# Altium schematic sheet MercurialSDR_FPGA_P&P.SchDoc: p2020 v1
size A4; Author: RF-Lab; DrawnBy: RF-Lab; Revision: Rev1.0; SheetNumber: 4; SheetTotal: 6; ProjectName: MercurialSDR
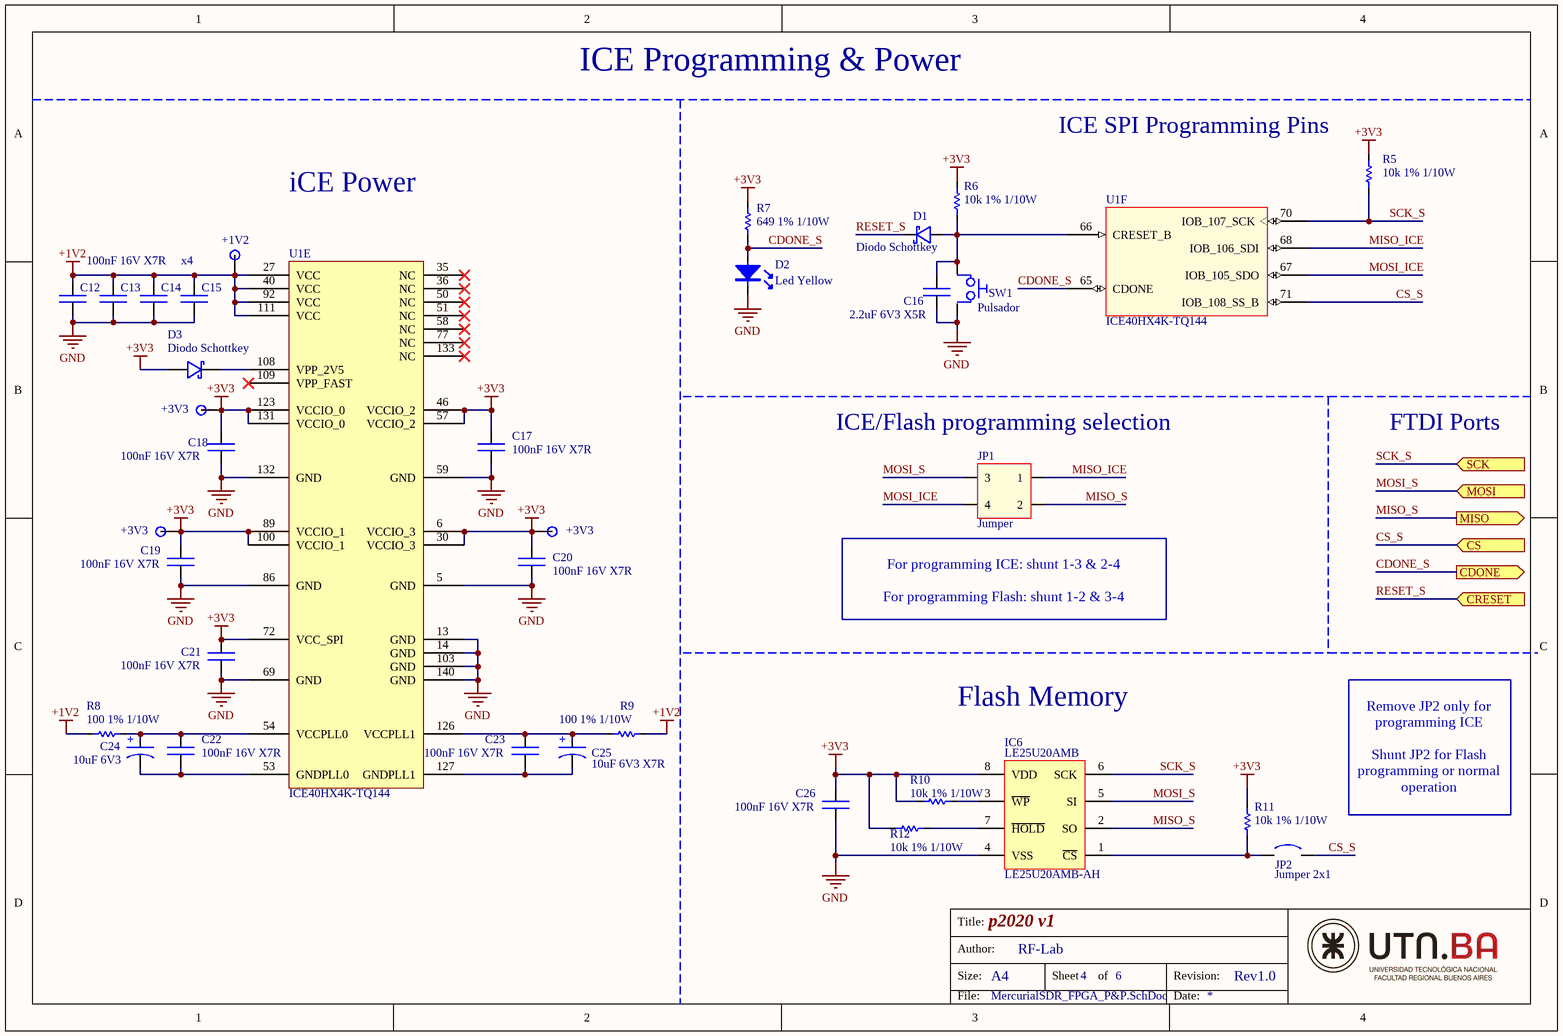
[diagram p0: MercurialSDR_FPGA_P&P.SchDoc]

## Parts
C12  100nF 16V X7R - CL10B104KO8NNNC  [CAP_0603]  (value not drawn)
C13  100nF 16V X7R - CL10B104KO8NNNC  [CAP_0603]  (value not drawn)
C14  100nF 16V X7R - CL10B104KO8NNNC  [CAP_0603]  (value not drawn)
C15  value 100nF 16V X7R  [CAP_0603]  (hidden comment: 100nF 16V X7R - CL10B104KO8NNNC)
C16  value 2.2uF 6V3 X5R  [CAP_0603]  (hidden comment: 2.2uF 6V3 X5R - CL10A225KQ8NNNC)
C17  value 100nF 16V X7R  [CAP_0603]  (hidden comment: 100nF 16V X7R - CL10B104KO8NNNC)
C18  value 100nF 16V X7R  [CAP_0603]  (hidden comment: 100nF 16V X7R - CL10B104KO8NNNC)
C19  value 100nF 16V X7R  [CAP_0603]  (hidden comment: 100nF 16V X7R - CL10B104KO8NNNC)
C20  value 100nF 16V X7R  [CAP_0603]  (hidden comment: 100nF 16V X7R - CL10B104KO8NNNC)
C21  value 100nF 16V X7R  [CAP_0603]  (hidden comment: 100nF 16V X7R - CL10B104KO8NNNC)
C22  value 100nF 16V X7R  [CAP_0603]  (hidden comment: 100nF 16V X7R - CL10B104KO8NNNC)
C23  value 100nF 16V X7R  [CAP_0603]  (hidden comment: 100nF 16V X7R - CL10B104KO8NNNC)
C24  value 10uF 6V3  [CAP_TANT_1206]  (hidden comment: 10uF 6V3 - TAJA106K006RNJ)
C25  value 10uF 6V3 X7R  [CAP_TANT_1206]  (hidden comment: 10uF 6V3 X7R- TAJA106K006RNJ)
C26  value 100nF 16V X7R  [CAP_0603]  (hidden comment: 100nF 16V X7R - CL10B104KO8NNNC)
D1  value Diodo Schottkey  [SOD-523]  (hidden comment: RB521S30T1G)
D2  value Led Yellow  [LED_0603]  (hidden comment: LTST-C190KSKT)
D3  value Diodo Schottkey  [SOD-323]  (hidden comment: NSR0530HT1G)
IC6  LE25U20AMB  Part Number: LE25U20AMB-AH  [SOIC-8]
JP1  Jumper  [Jumper 2x2]
JP2  Jumper 2x1  [Jumper 2x1]
R5  value 10k 1% 1/10W  [RES_0603]  (hidden comment: 10k 1% 1/10W - CR0603-FX-1002EAS)
R6  value 10k 1% 1/10W  [RES_0603]  (hidden comment: 10k 1% 1/10W - CR0603-FX-1002EAS)
R7  value 649 1% 1/10W  [RES_0603]  (hidden comment: 649 1% 1/10W - RC0603FR-07649RL)
R8  value 100 1% 1/10W  [RES_0603]  (hidden comment: 100 1% 1/10W - CR0603-FX-1000ELF)
R9  value 100 1% 1/10W  [RES_0603]  (hidden comment: 100 1% 1/10W - CR0603-FX-1000ELF)
R10  value 10k 1% 1/10W  [RES_0603]  (hidden comment: 10k 1% 1/10W - CR0603-FX-1002EAS)
R11  value 10k 1% 1/10W  [RES_0603]  (hidden comment: 10k 1% 1/10W - CR0603-FX-1002EAS)
R12  value 10k 1% 1/10W  [RES_0603]  (hidden comment: 10k 1% 1/10W - CR0603-FX-1002EAS)
SW1  value Pulsador  [SWITCH_6X6mm]  (hidden comment: PTS645SM43SMTR92 LFS)
TP2  TP Name: +1V2  [TP_TH]  (hidden comment: Test Point)
TP3  TP Name: +3V3  [TP_TH]  (hidden comment: Test Point)
TP4  TP Name: +3V3  [TP_TH]  (hidden comment: Test Point)
TP5  TP Name: +3V3  [TP_TH]  (hidden comment: Test Point)
U1  ICE40HX4K-TQ144  [LATC-TQFP-144_L]  (parts E,F of 6)

## Ports
CDONE (out), CRESET (in), CS (in), MISO (out), MOSI (in), SCK (in)

## Nets
+1V2: C12.1 C13.1 C14.1 C15.1 R8.2 R9.1 TP2.1(TP?) U1.27(VCC) U1.40(VCC) U1.92(VCC) U1.111(VCC)
+3V3: C17.2 C18.2 C19.2 C20.2 C21.2 C26.2 D3.1(A) IC6.8(VDD) R5.1 R6.1 R7.1 R10.1 R11.2 R12.1 TP3.1(TP?) TP4.1(TP?) TP5.1(TP?) U1.6(VCCIO_3) U1.30(VCCIO_3) U1.46(VCCIO_2) U1.57(VCCIO_2) U1.72(VCC_SPI) U1.89(VCCIO_1) U1.100(VCCIO_1) U1.123(VCCIO_0) U1.131(VCCIO_0)
GND: C12.2 C13.2 C14.2 C15.2 C16.2 C17.1 C18.1 C19.1 C20.1 C21.1 C26.1 D2.2(K) IC6.4(VSS) SW1.4 U1.5(GND) U1.13(GND) U1.14(GND) U1.59(GND) U1.69(GND) U1.86(GND) U1.103(GND) U1.132(GND) U1.140(GND)
CDONE_S: D2.1(A) R7.2 U1.65(CDONE) ; port CDONE
CS_S: JP2.2 U1.71(IOB_108_SS_B) ; port CS
MISO_ICE: JP1.1 U1.68(IOB_106_SDI)
MISO_S: IC6.2(SO) JP1.2 ; port MISO
MOSI_ICE: JP1.4 U1.67(IOB_105_SDO)
MOSI_S: IC6.5(SI) JP1.3 ; port MOSI
RESET_S: D1.2(K) ; port CRESET
SCK_S: IC6.6(SCK) R5.2 U1.70(IOB_107_SCK) ; port SCK
NetC16_1: C16.1 D1.1(A) R6.2 SW1.1 U1.66(CRESET_B)
NetC22_1: C22.1 C24.1 R8.1 U1.54(VCCPLL0)
NetC22_2: C22.2 C24.2 U1.53(GNDPLL0)
NetC23_1: C23.1 C25.1 R9.2 U1.126(VCCPLL1)
NetC23_2: C23.2 C25.2 U1.127(GNDPLL1)
NetD3_2: D3.2(K) U1.108(VPP_2V5)
NetIC6_1: IC6.1(~{CS}) JP2.1 R11.1
NetIC6_3: IC6.3(~{WP}) R10.2
NetIC6_7: IC6.7(~{HOLD}) R12.2

Not connected (* = marked no-connect by the designer): SW1 2 3; U1 35(NC)* 36(NC)* 50(NC)* 51(NC)* 58(NC)* 77(NC)* 109(VPP_FAST)* 133(NC)*

## Notes on the sheet
- ICE Programming & Power
- (near R5) ICE SPI Programming Pins
- iCE Power
- x4
- (near JP1) ICE/Flash programming selection
- FTDI Ports
- (near JP1) For programming ICE: shunt 1-3 & 2-4
  For programming Flash: shunt 1-2 & 3-4
- Flash Memory
- Remove JP2 only for programming ICE
  Shunt JP2 for Flash programming or normal operation
- Title:
- Size:
- Author:
- A4
- Sheet
- of
- Revision:
- File:
- Date:
- (in symbol Cap Pol) +

## Library data of the parts
C12 C15-C23 C26 = Cap: Capacitor no polarizado
  C12: Value: 100nF 16V X7R
C13 C14 = Cap: Capacitor no polarizado; Material: Ceramic; Value: 100nF; Temp Coef: X7R; Part Number: CL10B104KO8NNNC; VR: 16V
C24 C25 = Cap Pol: Capacitor polarizado
D1 D3 = Diodo_Schottky: Diodo Schottkey
  D3: Part Number: NSR0530HT1G
D2 = Led
IC6 = LE25U20AMB: Flash Memmory SPI (256Kx8)
JP1 = Jumper 2x2
JP2 = Jumper: Part Number: *
R5-R12 = Res: Resistor
  R9: Power: 1/10W; Part Number: CR0603-FX-1000ELF; Tolerance: 1%
SW1 = Pulsador
U1 = ICE40HX4K-TQ144: iCE40 HX4K Series FPGA Family, 3520 Logic Cells, 1.2 V Core, 80 K Embedded RAM Bits, 144-pin TQFP, Pb-Free, Tray; Manufacturer: Lattice Semiconductor; Phase-Locked Loops: 2; Supply Voltage: 1.2V; Logic Cells: 3520; Embedded RAM Bits: 80K; ComponentLink1Description: Manufacturer URL; ComponentLink2Description: Datasheet; DatasheetVersion: Rev. 02.9; Mounting Technology: Surface Mount; ComponentLink3URL: http://www.latticesemi.com/lit/docs/package/pkg.pdf; ComponentLink3Description: Package Specification; ComponentLink1URL: http://www.latticesemi.com/en; ComponentLink2URL: http://www.latticesemi.com/~/media/Documents/DataSheets/iCE/iCE40LPHXFamilyDataSheet.pdf; PackageReference: TQFP-144; Packing: Tray; Part Number: ICE40HX4K-TQ144; PackageDescription: 144-Pin Thin Quad Flat Package, Body 20 x 20 mm, Pitch 0.5 mm; PackageVersion: Rev. 03.9, 02/2013; RoHS: TRUE